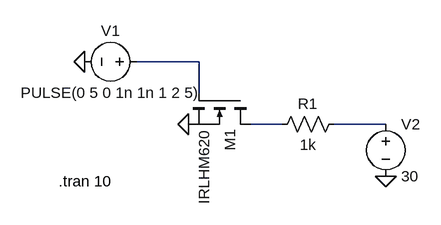
[diagram p0: schematic common source.asc]
common source.asc, the LTspice schematic file:
Version 4.1
SHEET 1 880 680
WIRE 160 80 64 80
WIRE 160 128 160 80
WIRE 288 176 240 176
WIRE 448 176 368 176
FLAG -16 80 0
FLAG 144 176 0
FLAG 448 256 0
SYMBOL nmos 240 128 R90
SYMATTR InstName M1
SYMATTR Value IRLHM620
SYMBOL voltage 80 80 R90
WINDOW 0 -32 56 VBottom 2
WINDOW 3 32 56 VTop 2
WINDOW 123 0 0 Left 0
WINDOW 39 0 0 Left 0
SYMATTR InstName V1
SYMATTR Value PULSE(0 5 0 1n 1n 1 2 5)
SYMBOL res 384 160 R90
WINDOW 0 0 56 VBottom 2
WINDOW 3 32 56 VTop 2
SYMATTR InstName R1
SYMATTR Value 1k
SYMBOL voltage 448 160 R0
WINDOW 123 0 0 Left 0
WINDOW 39 0 0 Left 0
SYMATTR InstName V2
SYMATTR Value 30
TEXT -56 264 Left 2 !.tran 10

The netlist it stands for:
* common source.asc
M1 N002 N001 0 0 IRLHM620
V1 N001 0 PULSE(0 5 0 1n 1n 1 2 5)
R1 N003 N002 1k
V2 N003 0 30
.model NMOS NMOS
.model PMOS PMOS
.lib standard.mos
.tran 10
.backanno
.end